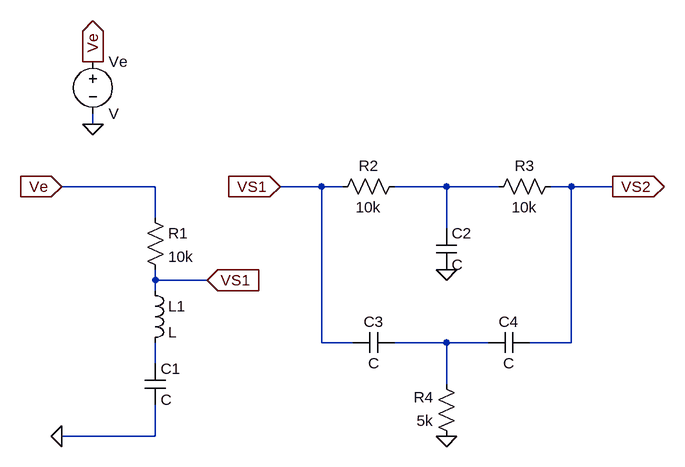
[diagram p0: schematic tp_s4.asc]
tp_s4.asc, the LTspice schematic file:
Version 4
SHEET 1 904 680
WIRE 0 -128 0 -144
WIRE 96 -32 -48 -32
WIRE 352 -32 288 -32
WIRE 384 -32 352 -32
WIRE 544 -32 464 -32
WIRE 624 -32 544 -32
WIRE 736 -32 704 -32
WIRE 800 -32 736 -32
WIRE 96 16 96 -32
WIRE 544 32 544 -32
WIRE 96 112 96 96
WIRE 176 112 96 112
WIRE 96 128 96 112
WIRE 352 208 352 -32
WIRE 400 208 352 208
WIRE 544 208 464 208
WIRE 608 208 544 208
WIRE 736 208 736 -32
WIRE 736 208 672 208
WIRE 96 240 96 208
WIRE 544 272 544 208
WIRE 96 352 96 304
WIRE 96 352 -48 352
FLAG 544 96 0
FLAG 544 352 0
FLAG 288 -32 VS1
IOPIN 288 -32 In
FLAG 800 -32 VS2
IOPIN 800 -32 Out
FLAG -48 352 0
FLAG 176 112 VS1
IOPIN 176 112 In
FLAG -48 -32 Ve
IOPIN -48 -32 In
FLAG 0 -128 0
FLAG 0 -224 Ve
IOPIN 0 -224 Out
SYMBOL res 80 0 R0
SYMATTR InstName R1
SYMATTR Value 10k
SYMBOL ind 80 112 R0
SYMATTR InstName L1
SYMBOL cap 80 240 R0
SYMATTR InstName C1
SYMBOL cap 528 32 R0
SYMATTR InstName C2
SYMBOL cap 464 192 R90
WINDOW 0 0 32 VBottom 2
WINDOW 3 32 32 VTop 2
SYMATTR InstName C3
SYMBOL cap 672 192 R90
WINDOW 0 0 32 VBottom 2
WINDOW 3 32 32 VTop 2
SYMATTR InstName C4
SYMBOL res 480 -48 R90
WINDOW 0 0 56 VBottom 2
WINDOW 3 32 56 VTop 2
SYMATTR InstName R2
SYMATTR Value 10k
SYMBOL res 720 -48 R90
WINDOW 0 0 56 VBottom 2
WINDOW 3 32 56 VTop 2
SYMATTR InstName R3
SYMATTR Value 10k
SYMBOL res 560 368 R180
WINDOW 0 36 76 Left 2
WINDOW 3 36 40 Left 2
SYMATTR InstName R4
SYMATTR Value 5k
SYMBOL voltage 0 -240 R0
SYMATTR InstName Ve

The netlist it stands for:
* tp_s4.asc
R1 Ve VS1 10k
L1 VS1 N003 L
C1 N003 0 C
C2 N001 0 C
C3 N002 VS1 C
C4 VS2 N002 C
R2 N001 VS1 10k
R3 VS2 N001 10k
R4 0 N002 5k
Ve Ve 0 V
.backanno
.end